# EAGLE design pcb (EAGLE 9.6.2)
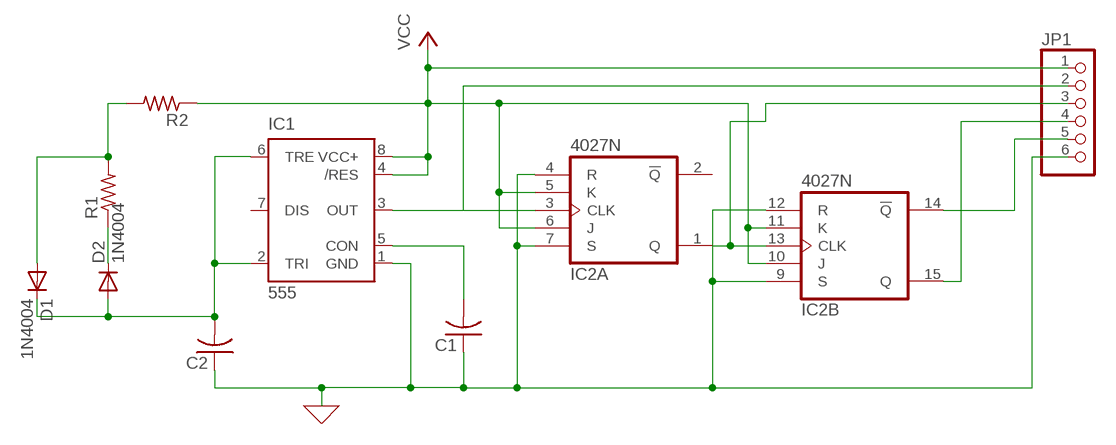
[diagram p0: schematic, sheet 1]

## Parts
C1  C-US025-025X050  [C025-025X050]
C2  C-US025-025X050  [C025-025X050]
D1  1N4004  [DO41-10]
D2  1N4004  [DO41-10]
IC1  555  555P  [DIP08]
IC2  4027N  [DIL16]
JP1  PINHD-1X6CB  [1X06-CLEANBIG]
R1  R-US_0204/5  [0204/5]
R2  R-US_0204/5  [0204/5]

## Nets
0: C1.1 C2.1 IC1.1(GND) IC2.4(A:R) IC2.7(A:S) IC2.9(B:S) IC2.12(B:R) JP1.6 ; supply symbol labelled GND
N$1: C2.2 D1.C D2.A IC1.2(TRI) IC1.6(TRE)
N$2: C1.2 IC1.5(CON)
N$3: D2.C R1.1
N$4: D1.A R1.2 R2.2
N$5: IC1.3(OUT) IC2.3(A:CLK) JP1.2
N$6: IC2.1(A:Q) IC2.13(B:CLK) JP1.3
N$7: IC2.15(B:Q) JP1.4
N$8: IC2.14(B:!Q) JP1.5
VCC: IC1.4(/RES) IC1.8(VCC+) IC2.5(A:K) IC2.6(A:J) IC2.10(B:J) IC2.11(B:K) JP1.1 R2.1
Unconnected: IC1.7(DIS) IC2.2(A:!Q)

## Power pins joined to a net without a drawn wire
VDD: IC2.16(P:VDD)
VSS: IC2.8(P:VSS)

## Library data of the parts
C1 C2 = adafruit:C-US: CAPACITOR, American symbol
D1 D2 = adafruit:1N4004: DIODE General purpose 1N400x type rectifier (With bigger pads) http://www.ladyada.net/library/pcb/eaglelibrary.html
IC1 = SparkFun-IC-Special-Function:555: General purpose bipolar Timer Datasheet <http://www.sparkfun.com/datasheets/Components/General/ne555.pdf> SparkFun Products SparkFun SparkPunk Sequencer Kit <https://www.sparkfun.com/products/12707> (KIT-12707) Storefront Component: 555 Timer <https://www.sparkfun.com/products/9273> (COM-09273) Two parts valid for production: VFP: IC-11930 (M7555 PTH) VFP: IC-09173 (555 PTH) - Preferred; PROD_ID: IC-09173; PROD_ID_ALT: IC-09173
IC2 = 40xx:4027: Dual JK FLIP FLOP
JP1 = adafruit:PINHD-1X6: PIN HEADER
R1 R2 = adafruit:R-US_: RESISTOR, American symbol

## Board
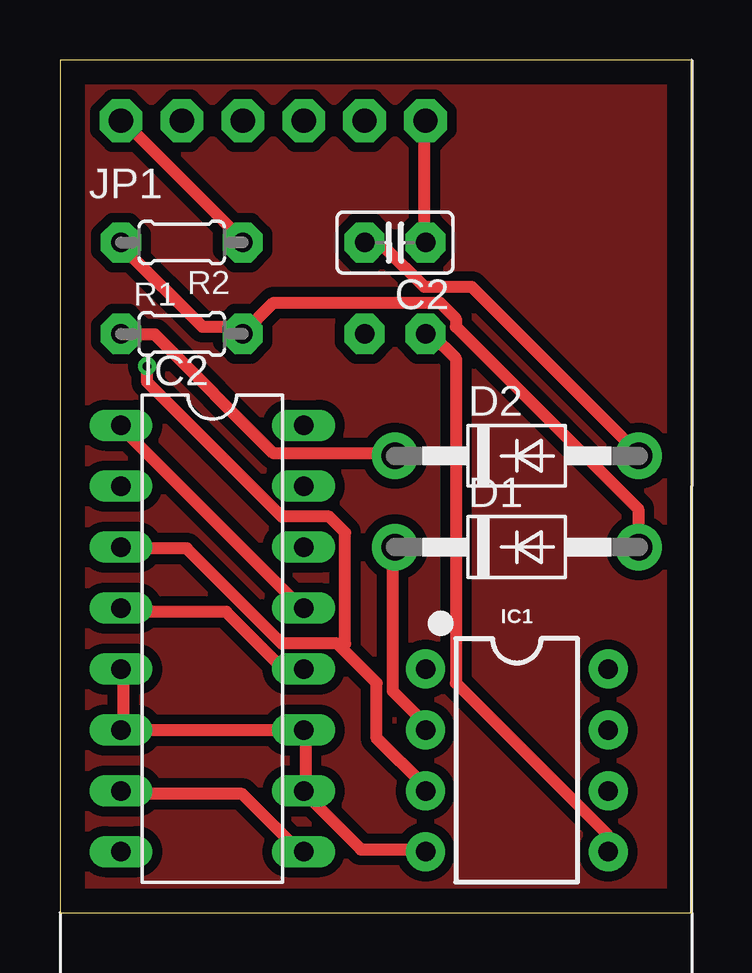
[diagram p1: board, top side]
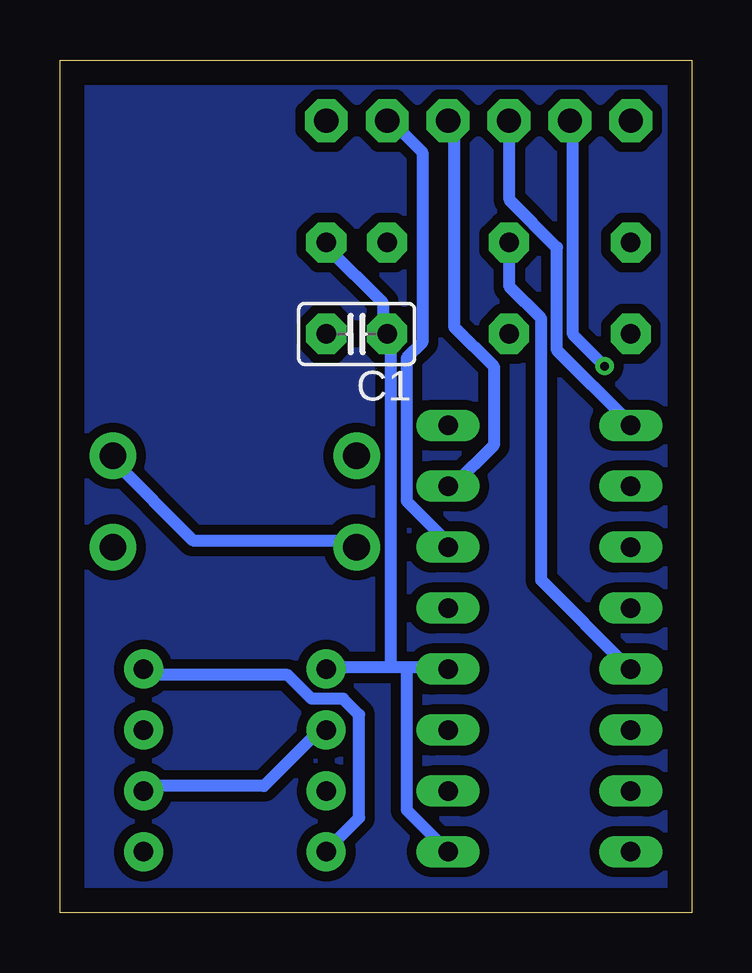
[diagram p2: board, bottom side, seen from below]

Size 26.34 x 35.55 mm. Coordinates in mm from the lower left corner, seen from the top.
Outline: 0,0 26.34,0 26.34,35.55 0,35.55 0,0
Copper layers (1*16): Top 0.035mm / dielectric 1.5mm / Bottom 0.035mm
Design rules "default": minimum track width 6mil, minimum drill 0.35mm, track to track 6mil, track to pad 6mil, pad to pad 6mil, via to via 6mil, smd to smd 6mil, copper to edge 40mil, drill to drill 6mil, minimum pad ring 10mil, minimum via ring 8mil, stop-mask expansion 4mil, vias tented up to drill 0mil, thermal gap 10mil

### Footprints (pad centres in the part's own frame; a part is rotated, then mirrored left to right if it is on the bottom)
C025-025X050 = drill 0.813 pad 1.676 octagon: 1 -1.27,0; 2 1.27,0
DO41-10 = drill 1.118 pad 1.93: A 5.08,0; C -5.08,0
DIP08 = drill 0.813 pad 1.626: 1 -3.81,-3.81; 2 -1.27,-3.81; 3 1.27,-3.81; 4 3.81,-3.81; 5 3.81,3.81; 6 1.27,3.81; 7 -1.27,3.81; 8 -3.81,3.81
DIL16 = drill 0.813 long: 1 -8.89,-3.81; 2 -6.35,-3.81; 3 -3.81,-3.81; 4 -1.27,-3.81; 5 1.27,-3.81; 6 3.81,-3.81; 7 6.35,-3.81; 8 8.89,-3.81; 9 8.89,3.81; 10 6.35,3.81; 11 3.81,3.81; 12 1.27,3.81; 13 -1.27,3.81; 14 -3.81,3.81; 15 -6.35,3.81; 16 -8.89,3.81
1X06-CLEANBIG = drill 1.016 pad 1.778 octagon: 1 -6.35,0; 2 -3.81,0; 3 -1.27,0; 4 1.27,0; 5 3.81,0; 6 6.35,0
0204/5 = drill 0.813 pad 1.676 octagon: 1 -2.54,0; 2 2.54,0

### Placement (x,y rotation side)
C1  13.97,24.13 180 bottom
C2  13.97,27.94 180 top
D1  19.05,15.24 0 top
D2  19.05,19.05 0 top
IC1  19.05,6.35 270 top
IC2  6.35,11.43 270 top
JP1  8.89,33.02 0 top
R1  5.08,24.13 0 top
R2  5.08,27.94 180 top

### Tracks (layer width: path | path; a pad name or v marks a point on that pad's centre or on a via)
0
  Top 0.508: JP1.6 15.19,33.02 15.19,28.07 C2.1 | IC2.7 2.64,4.95 7.59,4.95 9.91,2.64 IC2.9 | IC2.4 2.64,12.55 6.93,12.55 9.25,10.24 9.91,10.24 IC2.12
  Bottom 0.508: C2.1 15.19,27.74 12.88,25.43 12.88,24.43 C1.1 12.55,24.11 12.55,10.24 | 11.89,10.24 10.24,10.24 IC2.12 | 11.89,10.24 12.55,10.24 | 12.55,10.24 15.19,10.24 IC1.1 | 11.89,10.24 11.89,4.29 10.24,2.64 IC2.9
GND
  pour Top (isolate 0.406): 0,0 26,0 26,35 0,35
  pour Bottom (isolate 0.406): 0,0 26,0 26,36 0,36
N$1
  Top 0.508: IC1.2 15.19,7.93 13.87,9.25 13.87,15.19 D1.C | C2.2 12.88,27.74 13.54,27.74 15.19,26.09 17.17,26.09 24.11,19.15 D2.A
  Bottom 0.508: IC1.6 22.78,5.28 17.83,5.28 15.52,7.6 IC1.2 | D1.C 14.2,15.52 20.8,15.52 24.11,18.82 D2.A
N$2
  Top 0.508: IC1.5 22.78,2.64 22.78,3.3 16.51,9.58 16.51,23.11 15.52,24.11 C1.2
N$3
  Top 0.508: R1.1 2.64,24.11 3.96,24.11 8.91,19.15 13.87,19.15 D2.C
N$4
  Top 0.508: R2.2 2.64,27.74 5.94,24.43 7.59,24.43 R1.2 8.91,25.43 15.85,25.43 16.51,24.77 16.51,24.43 24.11,16.84 24.11,15.52 D1.A
N$5  (via drill 0.35)
  Top 0.508: 11.72,11.06 13.21,9.58 13.21,7.26 15.19,5.28 IC1.3 | 11.72,11.06 11.56,11.23 9.25,11.23 5.28,15.19 2.64,15.19 IC2.3 | v3.63,22.78 3.63,22.12 9.25,16.51 11.23,16.51 11.89,15.85 11.89,11.23 11.72,11.06
  Bottom 0.508: v3.63,22.78 4.95,24.11 4.95,33.02 JP1.2
N$6
  Top 0.508: IC2.1 2.64,20.14 9.91,12.88 IC2.13
  Bottom 0.508: JP1.3 7.59,33.02 7.59,29.72 5.61,27.74 5.61,23.44 2.64,20.47 IC2.1
N$7
  Bottom 0.508: IC2.15 9.91,17.83 8.25,19.48 8.25,22.78 9.91,24.43 9.91,33.02 JP1.4
N$8
  Bottom 0.508: IC2.14 10.24,15.52 11.89,17.17 11.89,23.11 11.23,23.77 11.23,31.7 12.55,33.02 JP1.5
VCC
  Top 0.508: R2.1 7.59,28.07 2.64,33.02 JP1.1 | IC2.5 2.64,9.91 2.64,7.93 IC2.6 2.64,7.6 9.91,7.6 IC2.11 10.24,7.6 10.24,5.28 IC2.10 10.24,4.95 12.55,2.64 15.19,2.64 IC1.4
  Bottom 0.508: IC1.8 22.78,9.91 16.84,9.91 15.85,8.92 14.53,8.92 13.87,8.25 13.87,3.96 15.19,2.64 IC1.4 | R2.1 7.59,27.74 7.59,26.09 6.27,24.77 6.27,13.87 2.64,10.24 IC2.5